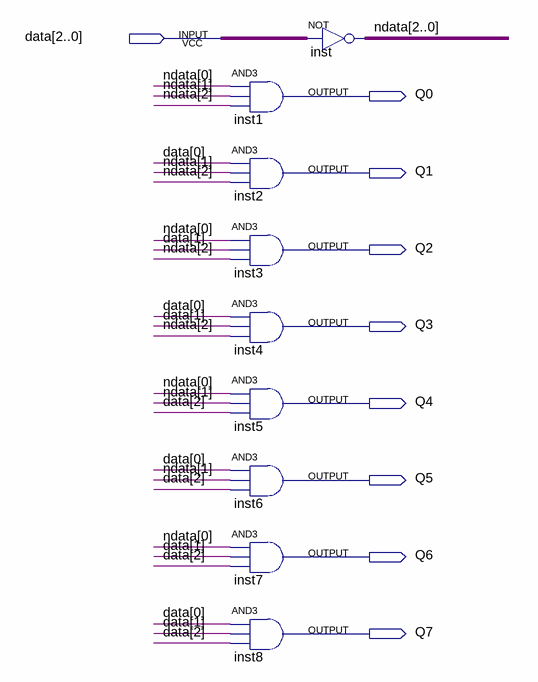
[diagram p0: schematic sheet]
// Quartus schematic dmux1in8.bdf as structural Verilog: 9 symbols, 9 pins
module dmux1in8 (
  input  [2:0] data,
  output Q0,
  output Q1,
  output Q2,
  output Q3,
  output Q4,
  output Q5,
  output Q6,
  output Q7
);

  wire [2:0] ndata;

  and inst1 (Q0, ndata[0], ndata[1], ndata[2]);
  and inst2 (Q1, data[0], ndata[1], ndata[2]);
  and inst3 (Q2, ndata[0], data[1], ndata[2]);
  and inst4 (Q3, data[0], data[1], ndata[2]);
  and inst5 (Q4, ndata[0], ndata[1], data[2]);
  and inst6 (Q5, data[0], ndata[1], data[2]);
  and inst7 (Q6, ndata[0], data[1], data[2]);
  and inst8 (Q7, data[0], data[1], data[2]);
  assign ndata = ~data;  // NOT inst, 3 bits wide
endmodule
